# EAGLE design CFA_c (EAGLE 9.4.2)
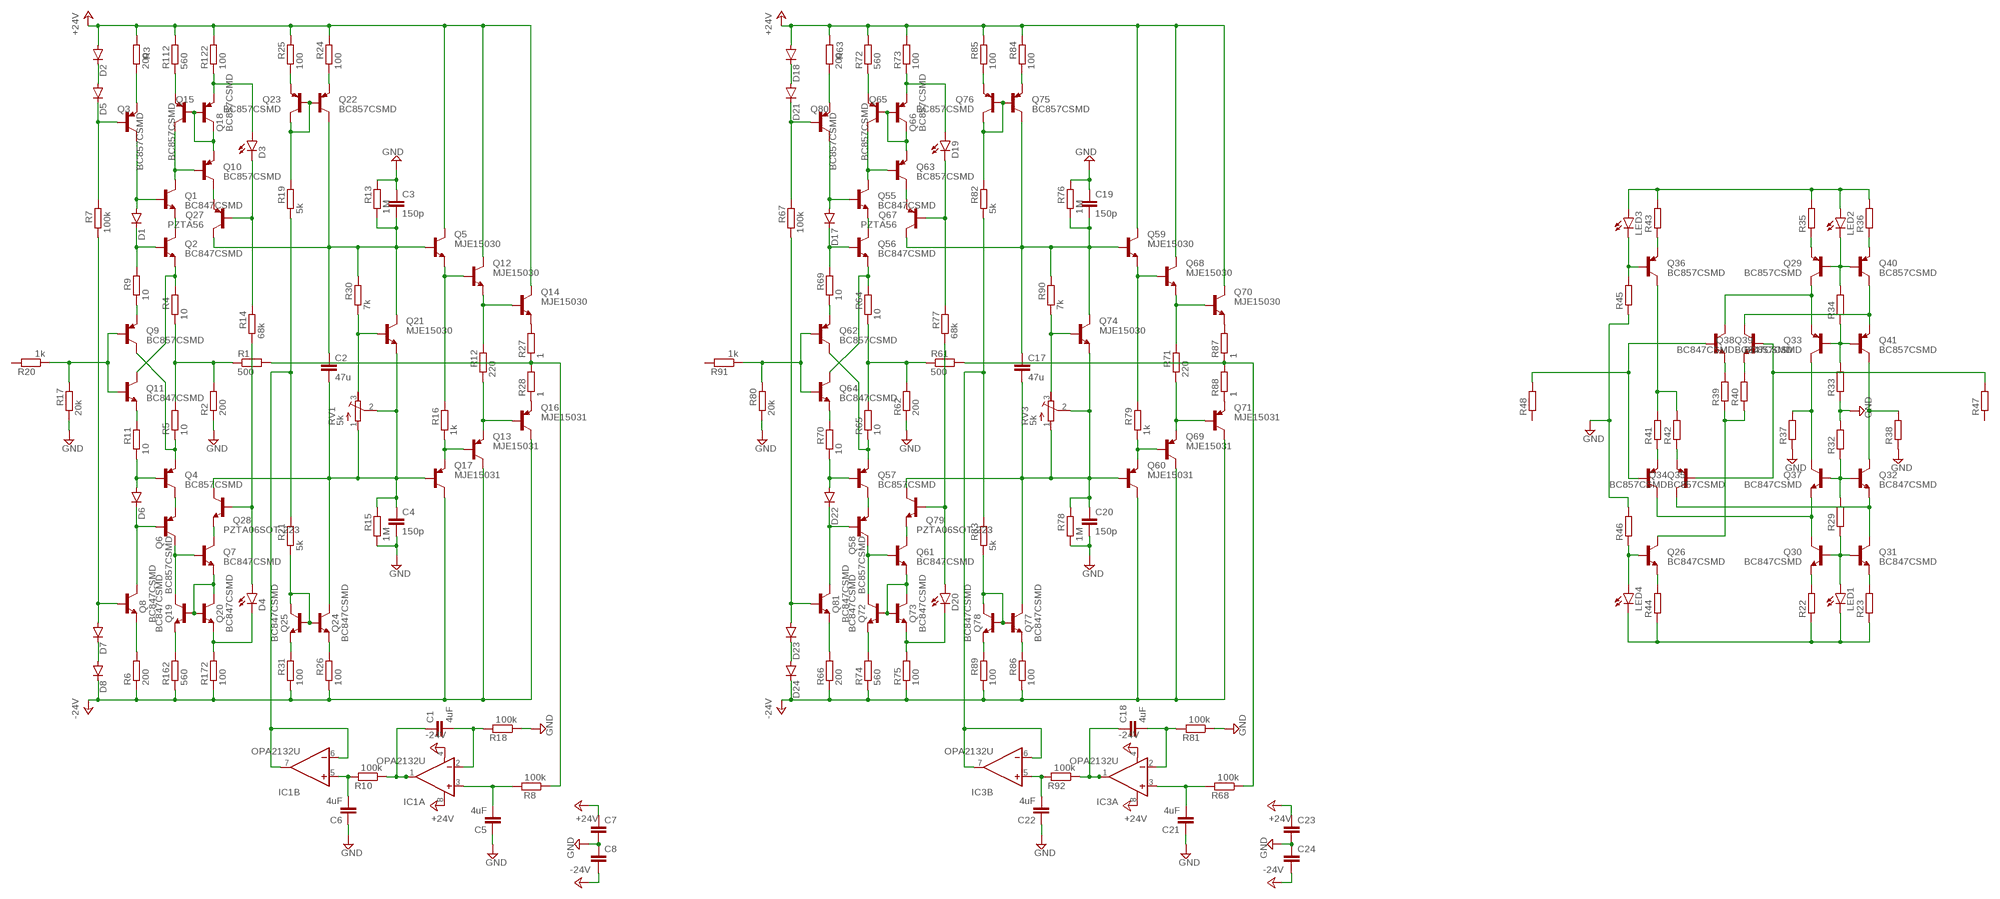
[diagram p0: schematic, sheet 1]

## Parts
C1  4uF  C-EUC1210  [C1210]
C2  47u  C-EUC1210  [C1210]
C3  150p  C-EUC0805  [C0805]
C4  150p  C-EUC0805  [C0805]
C5  4uF  C-EUC1210  [C1210]
C6  4uF  C-EUC1210  [C1210]
C7  C-EUC0603K  [C0603K]
C8  C-EUC0603K  [C0603K]
C17  47u  C-EUC1210  [C1210]
C18  4uF  C-EUC1210  [C1210]
C19  150p  C-EUC0805  [C0805]
C20  150p  C-EUC0805  [C0805]
C21  4uF  C-EUC1210  [C1210]
C22  4uF  C-EUC1210  [C1210]
C23  C-EUC0603K  [C0603K]
C24  C-EUC0603K  [C0603K]
D1  DIODE-SOD80C  [SOD80C]
D2  DIODE-SOD80C  [SOD80C]
D3  LEDCHIPLED_1206  [CHIPLED_1206]
D4  LEDCHIPLED_1206  [CHIPLED_1206]
D5  DIODE-SOD80C  [SOD80C]
D6  DIODE-SOD80C  [SOD80C]
D7  DIODE-SOD80C  [SOD80C]
D8  DIODE-SOD80C  [SOD80C]
D17  DIODE-SOD80C  [SOD80C]
D18  DIODE-SOD80C  [SOD80C]
D19  LEDCHIPLED_1206  [CHIPLED_1206]
D20  LEDCHIPLED_1206  [CHIPLED_1206]
D21  DIODE-SOD80C  [SOD80C]
D22  DIODE-SOD80C  [SOD80C]
D23  DIODE-SOD80C  [SOD80C]
D24  DIODE-SOD80C  [SOD80C]
IC1  OPA2132U  [SO08]
IC3  OPA2132U  [SO08]
LED1  LEDCHIPLED_1206  [CHIPLED_1206]
LED2  LEDCHIPLED_1206  [CHIPLED_1206]
LED3  LEDCHIPLED_1206  [CHIPLED_1206]
LED4  LEDCHIPLED_1206  [CHIPLED_1206]
Q1  BC847CSMD  [SOT23]
Q2  BC847CSMD  [SOT23]
Q3  BC857CSMD  [SOT23-BEC]
Q4  BC857CSMD  [SOT23-BEC]
Q5  MJE15030  MJD31C  [DPAK]
Q6  BC857CSMD  [SOT23-BEC]
Q7  BC847CSMD  [SOT23]
Q8  BC847CSMD  [SOT23]
Q9  BC857CSMD  [SOT23-BEC]
Q10  BC857CSMD  [SOT23-BEC]
Q11  BC847CSMD  [SOT23]
Q12  MJE15030  MJD31C  [DPAK]
Q13  MJE15031  MJD32C  [DPAK]
Q14  MJE15030  MJD31C  [DPAK]
Q15  BC857CSMD  [SOT23-BEC]
Q16  MJE15031  MJD32C  [DPAK]
Q17  MJE15031  MJD32C  [DPAK]
Q18  BC857CSMD  [SOT23-BEC]
Q19  BC847CSMD  [SOT23]
Q20  BC847CSMD  [SOT23]
Q21  MJE15030  MJD31C  [DPAK]
Q22  BC857CSMD  [SOT23-BEC]
Q23  BC857CSMD  [SOT23-BEC]
Q24  BC847CSMD  [SOT23]
Q25  BC847CSMD  [SOT23]
Q26  BC847CSMD  [SOT23]
Q27  PZTA56  [SOT223]
Q28  PZTA06SOT-223  [SOT223]
Q29  BC857CSMD  [SOT23-BEC]
Q30  BC847CSMD  [SOT23]
Q31  BC847CSMD  [SOT23]
Q32  BC847CSMD  [SOT23]
Q33  BC857CSMD  [SOT23-BEC]
Q34  BC857CSMD  [SOT23-BEC]
Q35  BC857CSMD  [SOT23-BEC]
Q36  BC857CSMD  [SOT23-BEC]
Q37  BC847CSMD  [SOT23]
Q38  BC847CSMD  [SOT23]
Q39  BC847CSMD  [SOT23]
Q40  BC857CSMD  [SOT23-BEC]
Q41  BC857CSMD  [SOT23-BEC]
Q55  BC847CSMD  [SOT23]
Q56  BC847CSMD  [SOT23]
Q57  BC857CSMD  [SOT23-BEC]
Q58  BC857CSMD  [SOT23-BEC]
Q59  MJE15030  MJD31C  [DPAK]
Q60  MJE15031  MJD32C  [DPAK]
Q61  BC847CSMD  [SOT23]
Q62  BC857CSMD  [SOT23-BEC]
Q63  BC857CSMD  [SOT23-BEC]
Q64  BC847CSMD  [SOT23]
Q65  BC857CSMD  [SOT23-BEC]
Q66  BC857CSMD  [SOT23-BEC]
Q67  PZTA56  [SOT223]
Q68  MJE15030  MJD31C  [DPAK]
Q69  MJE15031  MJD32C  [DPAK]
Q70  MJE15030  MJD31C  [DPAK]
Q71  MJE15031  MJD32C  [DPAK]
Q72  BC847CSMD  [SOT23]
Q73  BC847CSMD  [SOT23]
Q74  MJE15030  MJD31C  [DPAK]
Q75  BC857CSMD  [SOT23-BEC]
Q76  BC857CSMD  [SOT23-BEC]
Q77  BC847CSMD  [SOT23]
Q78  BC847CSMD  [SOT23]
Q79  PZTA06SOT-223  [SOT223]
Q80  BC857CSMD  [SOT23-BEC]
Q81  BC847CSMD  [SOT23]
R1  500  R-EU_MELF0204W  [MINI_MELF-0204W]
R2  200  R-EU_MELF0204W  [MINI_MELF-0204W]
R3  200  R-EU_MELF0204W  [MINI_MELF-0204W]
R4  10  R-EU_MELF0204W  [MINI_MELF-0204W]
R5  10  R-EU_MELF0204W  [MINI_MELF-0204W]
R6  200  R-EU_MELF0204W  [MINI_MELF-0204W]
R7  100k  R-EU_MELF0204W  [MINI_MELF-0204W]
R8  100k  R-EU_MELF0204W  [MINI_MELF-0204W]
R9  10  R-EU_MELF0204W  [MINI_MELF-0204W]
R10  100k  R-EU_MELF0204W  [MINI_MELF-0204W]
R11  10  R-EU_MELF0204W  [MINI_MELF-0204W]
R12  220  R-EU_MELF0204W  [MINI_MELF-0204W]
R13  1M  R-EU_MELF0204W  [MINI_MELF-0204W]
R14  68k  R-EU_MELF0204W  [MINI_MELF-0204W]
R15  1M  R-EU_MELF0204W  [MINI_MELF-0204W]
R16  1k  R-EU_MELF0204W  [MINI_MELF-0204W]
R17  20k  R-EU_MELF0204W  [MINI_MELF-0204W]
R18  100k  R-EU_MELF0204W  [MINI_MELF-0204W]
R19  5k  R-EU_MELF0204W  [MINI_MELF-0204W]
R20  1k  R-EU_MELF0204W  [MINI_MELF-0204W]
R21  5k  R-EU_MELF0204W  [MINI_MELF-0204W]
R22  R-EU_MELF0204W  [MINI_MELF-0204W]
R23  R-EU_MELF0204W  [MINI_MELF-0204W]
R24  100  R-EU_MELF0204W  [MINI_MELF-0204W]
R25  100  R-EU_MELF0204W  [MINI_MELF-0204W]
R26  100  R-EU_MELF0204W  [MINI_MELF-0204W]
R27  1  R-EU_R4527  [R4527]
R28  1  R-EU_R4527  [R4527]
R29  R-EU_MELF0204W  [MINI_MELF-0204W]
R30  7k  R-EU_MELF0204W  [MINI_MELF-0204W]
R31  100  R-EU_MELF0204W  [MINI_MELF-0204W]
R32  R-EU_MELF0204W  [MINI_MELF-0204W]
R33  R-EU_MELF0204W  [MINI_MELF-0204W]
R34  R-EU_MELF0204W  [MINI_MELF-0204W]
R35  R-EU_MELF0204W  [MINI_MELF-0204W]
R36  R-EU_MELF0204W  [MINI_MELF-0204W]
R37  R-EU_MELF0204W  [MINI_MELF-0204W]
R38  R-EU_MELF0204W  [MINI_MELF-0204W]
R39  R-EU_MELF0204W  [MINI_MELF-0204W]
R40  R-EU_MELF0204W  [MINI_MELF-0204W]
R41  R-EU_MELF0204W  [MINI_MELF-0204W]
R42  R-EU_MELF0204W  [MINI_MELF-0204W]
R43  R-EU_MELF0204W  [MINI_MELF-0204W]
R44  R-EU_MELF0204W  [MINI_MELF-0204W]
R45  R-EU_MELF0204W  [MINI_MELF-0204W]
R46  R-EU_MELF0204W  [MINI_MELF-0204W]
R47  R-EU_MELF0204W  [MINI_MELF-0204W]
R48  R-EU_MELF0204W  [MINI_MELF-0204W]
R61  500  R-EU_MELF0204W  [MINI_MELF-0204W]
R62  200  R-EU_MELF0204W  [MINI_MELF-0204W]
R63  200  R-EU_MELF0204W  [MINI_MELF-0204W]
R64  10  R-EU_MELF0204W  [MINI_MELF-0204W]
R65  10  R-EU_MELF0204W  [MINI_MELF-0204W]
R66  200  R-EU_MELF0204W  [MINI_MELF-0204W]
R67  100k  R-EU_MELF0204W  [MINI_MELF-0204W]
R68  100k  R-EU_MELF0204W  [MINI_MELF-0204W]
R69  10  R-EU_MELF0204W  [MINI_MELF-0204W]
R70  10  R-EU_MELF0204W  [MINI_MELF-0204W]
R71  220  R-EU_MELF0204W  [MINI_MELF-0204W]
R72  560  R-EU_MELF0204W  [MINI_MELF-0204W]
R73  100  R-EU_MELF0204W  [MINI_MELF-0204W]
R74  560  R-EU_MELF0204W  [MINI_MELF-0204W]
R75  100  R-EU_MELF0204W  [MINI_MELF-0204W]
R76  1M  R-EU_MELF0204W  [MINI_MELF-0204W]
R77  68k  R-EU_MELF0204W  [MINI_MELF-0204W]
R78  1M  R-EU_MELF0204W  [MINI_MELF-0204W]
R79  1k  R-EU_MELF0204W  [MINI_MELF-0204W]
R80  20k  R-EU_MELF0204W  [MINI_MELF-0204W]
R81  100k  R-EU_MELF0204W  [MINI_MELF-0204W]
R82  5k  R-EU_MELF0204W  [MINI_MELF-0204W]
R83  5k  R-EU_MELF0204W  [MINI_MELF-0204W]
R84  100  R-EU_MELF0204W  [MINI_MELF-0204W]
R85  100  R-EU_MELF0204W  [MINI_MELF-0204W]
R86  100  R-EU_MELF0204W  [MINI_MELF-0204W]
R87  1  R-EU_R4527  [R4527]
R88  1  R-EU_R4527  [R4527]
R89  100  R-EU_MELF0204W  [MINI_MELF-0204W]
R90  7k  R-EU_MELF0204W  [MINI_MELF-0204W]
R91  1k  R-EU_MELF0204W  [MINI_MELF-0204W]
R92  100k  R-EU_MELF0204W  [MINI_MELF-0204W]
R112  560  R-EU_MELF0204W  [MINI_MELF-0204W]
R122  100  R-EU_MELF0204W  [MINI_MELF-0204W]
R162  560  R-EU_MELF0204W  [MINI_MELF-0204W]
R172  100  R-EU_MELF0204W  [MINI_MELF-0204W]
RV1  5k  R-TRIMMTS63Y  [RTRIMTS63Y]
RV3  5k  R-TRIMMTS63Y  [RTRIMTS63Y]

## Nets
+24V: C7.1 C23.1 D2.A D18.A IC1.8(A:V+) IC3.8(A:V+) Q5.4(C) Q12.4(C) Q14.4(C) Q59.4(C) Q68.4(C) Q70.4(C) R3.2 R24.2 R25.2 R63.2 R72.2 R73.2 R84.2 R85.2 R112.2 R122.2
-24V: C8.2 C24.2 D8.C D24.C IC1.4(A:V-) IC3.4(A:V-) Q13.4(C) Q16.4(C) Q17.4(C) Q60.4(C) Q69.4(C) Q71.4(C) R6.1 R26.1 R31.1 R66.1 R74.1 R75.1 R86.1 R89.1 R162.1 R172.1
GND: C3.1 C4.2 C5.1 C6.1 C7.2 C8.1 C19.1 C20.2 C21.1 C22.1 C23.2 C24.1 R2.1 R13.2 R15.1 R17.1 R18.1 R32.2 R33.1 R37.1 R38.1 R45.1 R46.2 R62.1 R76.2 R78.1 R80.1 R81.1
N$1: Q21.1(B) R30.1 RV1.3(E)
N$2: Q3.E R3.1
N$3: D1.A Q1.1(B) Q3.C
N$4: D2.C D5.A
N$5: D5.C Q3.B R7.2
N$6: D1.C Q2.1(B) R9.2
N$7: Q1.2(E) Q2.3(C)
N$8: Q2.2(E) Q11.3(C) R4.2
N$9: R1.1 R2.2 R4.1 R5.2
N$10: Q4.E Q9.C R5.1
N$11: Q4.C Q6.E
N$12: D6.A Q4.B R11.1
N$13: D6.C Q6.B Q8.3(C)
N$14: Q8.2(E) R6.2
N$15: D7.A Q8.1(B) R7.1
N$16: D7.C D8.A
N$17: C1.1 IC1.1(A:OUT) R10.1
N$18: C6.2 IC1.5(B:+IN) R10.2
N$19: Q9.E R9.1
N$20: Q11.2(E) R11.2
N$21: Q15.E R112.1
N$22: Q9.B Q11.1(B) R17.2 R20.1
N$23: Q1.3(C) Q10.B Q15.C
N$24: Q10.E Q15.B Q18.B Q18.C
N$25: D3.A Q18.E R122.1
N$26: Q10.C Q27.3(E)
N$27: D3.C Q27.1(B) R14.2
N$28: Q7.2(E) Q19.1(B) Q20.1(B) Q20.3(C)
N$29: D4.C Q20.2(E) R172.2
N$30: Q19.2(E) R162.2
N$31: Q6.C Q7.1(B) Q19.3(C)
N$32: Q7.3(C) Q28.3(E)
N$33: D4.A Q28.1(B) R14.1
N$35: Q12.3(E) Q14.1(B) R12.2
N$36: C2.1 C3.2 Q5.1(B) Q21.4(C) Q22.C Q27.2(C) Q27.4(C) R13.1 R30.2
N$37: Q22.B Q23.B Q23.C R19.2
N$38: Q24.1(B) Q25.1(B) Q25.3(C) R21.1
N$39: Q23.E R25.1
N$40: Q22.E R24.1
N$41: IC1.6(B:-IN) IC1.7(B:OUT) R19.1 R21.2
N$42: R1.2 R8.1 R27.1 R28.2
N$43: Q25.2(E) R31.2
N$44: Q24.2(E) R26.2
N$45: Q5.3(E) Q12.1(B) R16.2
N$47: Q13.1(B) Q17.3(E) R16.1
N$48: C2.2 C4.1 Q17.1(B) Q21.3(E) Q24.3(C) Q28.2(C) Q28.4(C) R15.2 RV1.1(A) RV1.2(S)
N$50: Q13.3(E) Q16.1(B) R12.1
N$51: Q14.3(E) R27.2
N$52: Q16.3(E) R28.1
N$53: C1.2 IC1.2(A:-IN) R18.2
N$55: C5.2 IC1.3(A:+IN) R8.2
N$92: LED1.C LED4.C R22.1 R23.1 R44.1
N$93: Q30.2(E) R22.2
N$94: Q31.2(E) R23.2
N$95: Q31.3(C) Q32.2(E) Q34.C
N$96: Q30.3(C) Q35.C Q37.2(E)
N$97: LED1.A Q30.1(B) Q31.1(B) R29.1
N$98: Q32.1(B) Q37.1(B) R29.2 R32.1
N$99: Q33.C Q37.3(C) R37.2
N$100: Q32.3(C) Q41.C R38.2
N$101: Q33.B Q41.B R33.2 R34.1
N$102: Q29.C Q33.E Q39.3(C)
N$103: LED2.C Q29.B Q40.B R34.2
N$104: Q38.3(C) Q40.C Q41.E
N$105: Q29.E R35.1
N$106: Q40.E R36.1
N$107: LED2.A LED3.A R35.2 R36.2 R43.2
N$108: LED3.C Q36.B R45.2
N$109: Q36.E R43.1
N$110: Q36.C R41.2 R42.2
N$111: Q34.E R42.1
N$112: Q35.E R41.1
N$113: Q34.B Q38.1(B) R47.2
N$114: Q35.B Q39.1(B) R48.2
N$115: Q39.2(E) R39.2
N$116: Q38.2(E) R40.2
N$117: Q26.3(C) R39.1 R40.1
N$118: Q26.2(E) R44.2
N$119: LED4.A Q26.1(B) R46.1
N$122: Q74.1(B) R90.1 RV3.3(E)
N$183: Q80.E R63.1
N$184: D17.A Q55.1(B) Q80.C
N$185: D18.C D21.A
N$186: D21.C Q80.B R67.2
N$187: D17.C Q56.1(B) R69.2
N$188: Q55.2(E) Q56.3(C)
N$189: Q56.2(E) Q64.3(C) R64.2
N$190: R61.1 R62.2 R64.1 R65.2
N$191: Q57.E Q62.C R65.1
N$192: D22.A Q57.B R70.1
N$193: D22.C Q58.B Q81.3(C)
N$194: Q81.2(E) R66.2
N$195: D23.C D24.A
N$196: Q57.C Q58.E
N$197: Q62.E R69.1
N$198: Q64.2(E) R70.2
N$199: Q62.B Q64.1(B) R80.2 R91.1
N$200: Q55.3(C) Q63.B Q65.C
N$201: Q63.E Q65.B Q66.B Q66.C
N$202: Q65.E R72.1
N$203: D19.A Q66.E R73.1
N$204: Q63.C Q67.3(E)
N$205: D19.C Q67.1(B) R77.2
N$206: Q61.2(E) Q72.1(B) Q73.1(B) Q73.3(C)
N$207: D20.C Q73.2(E) R75.2
N$208: Q72.2(E) R74.2
N$209: Q58.C Q61.1(B) Q72.3(C)
N$210: Q61.3(C) Q79.3(E)
N$211: D20.A Q79.1(B) R77.1
N$212: C17.1 C19.2 Q59.1(B) Q67.2(C) Q67.4(C) Q74.4(C) Q75.C R76.1 R90.2
N$213: Q75.B Q76.B Q76.C R82.2
N$214: Q77.1(B) Q78.1(B) Q78.3(C) R83.1
N$215: Q76.E R85.1
N$216: Q75.E R84.1
N$217: IC3.6(B:-IN) IC3.7(B:OUT) R82.1 R83.2
N$218: R61.2 R68.1 R87.1 R88.2
N$219: Q78.2(E) R89.2
N$220: Q77.2(E) R86.2
N$221: Q59.3(E) Q68.1(B) R79.2
N$222: Q60.3(E) Q69.1(B) R79.1
N$223: C17.2 C20.1 Q60.1(B) Q74.3(E) Q77.3(C) Q79.2(C) Q79.4(C) R78.2 RV3.1(A) RV3.2(S)
N$224: Q68.3(E) Q70.1(B) R71.2
N$225: Q69.3(E) Q71.1(B) R71.1
N$226: Q70.3(E) R87.2
N$227: Q71.3(E) R88.1
N$228: C18.2 IC3.2(A:-IN) R81.2
N$229: C21.2 IC3.3(A:+IN) R68.2
N$230: D23.A Q81.1(B) R67.1
N$232: C18.1 IC3.1(A:OUT) R92.1
N$233: C22.2 IC3.5(B:+IN) R92.2
Unconnected: R20.2 R47.1 R48.1 R91.2

## Library data of the parts
C1-C6 C17-C22 = Vwvwbg:C-EU: CAPACITOR, European symbol; SPICEPREFIX: C
C7 C8 C23 C24 = Vwvwbg:C-EU: CAPACITOR, European symbol
D1 D2 D5-D8 D17 D18 D21-D24 = diode:DIODE-: DIODE; SPICEPREFIX: D
D3 D4 D19 D20 LED4 = led:LED: LED OSRAM: - CHIPLED LG R971, LG N971, LY N971, LG Q971, LY Q971, LO R971, LY R971 LH N974, LH R974 LS Q976, LO Q976, LY Q976 LO Q996 - Hyper CHIPLED LW Q18S LB Q993, LB Q99A, LB R99A - SideLED LS A670, LO A670, LY A670, LG A670, LP A670 LB A673, LV A673, LT A673, LW A673 LH A674 LY A675 LS A676, LA A676, LO A676, LY A676, LW A676 LS A679, LY A679, LG A679 - Hyper Micro SIDELED® LS Y876, LA Y876, LO Y876, LY Y876 LT Y87S - SmartLED LW L88C, LW L88S LB L89C, LB L89S, LG L890 LS L89K, LO L89K, LY L89K LS L896, LA L896, LO L896, LY L896 - TOPLED LS T670, LO T670, LY T670, LG T670, LP T670 LSG T670, LSP T670, LSY T670, LOP T670, LYG T670 LG T671, LOG T671, LSG T671 LB T673, LV T673, LT T673, LW T673 LH T674 LS T676, LA T676, LO T676, LY T676, LB T676, LH T676, LSB T676, LW T676 LB T67C, LV T67C, LT T67C, LS T67K, LO T67K, LY T67K, LW E67C LS E67B, LA E67B, LO E67B, LY E67B, LB E67C, LV E67C, LT E67C LW T67C LS T679, LY T679, LG T679 LS T770, LO T770, LY T770, LG T770, LP T770 LB T773, LV T773, LT T773, LW T773 LH T774 LS E675, LA E675, LY E675, LS T675 LS T776, LA T776, LO T776, LY T776, LB T776 LHGB T686 LT T68C, LB T68C - Hyper Mini TOPLED® LB M676 - Mini TOPLED Santana® LG M470 LS M47K, LO M47K, LY M47K Source: http://www.osram.convergy.de LUXEON: - LUMILED® LXK2-PW12-R00, LXK2-PW12-S00, LXK2-PW14-U00, LXK2-PW14-V00 LXK2-PM12-R00, LXK2-PM12-S00, LXK2-PM14-U00 LXK2-PE12-Q00, LXK2-PE12-R00, LXK2-PE12-S00, LXK2-PE14-T00, LXK2-PE14-U00 LXK2-PB12-K00, LXK2-PB12-L00, LXK2-PB12-M00, LXK2-PB14-N00, LXK2-PB14-P00, LXK2-PB14-Q00 LXK2-PR12-L00, LXK2-PR12-M00, LXK2-PR14-Q00, LXK2-PR14-R00 LXK2-PD12-Q00, LXK2-PD12-R00, LXK2-PD12-S00 LXK2-PH12-R00, LXK2-PH12-S00 LXK2-PL12-P00, LXK2-PL12-Q00, LXK2-PL12-R00 Source: www.luxeon.com KINGBRIGHT: KA-3528ASYC Source: www.kingbright.com; SPICEPREFIX: D
IC1 IC3 = burr-brown:OPA2132: High Speed FET-Input Operational Amplifiers< Product Folder:OPA2132; MF: TEXAS INSTRUMENTS; MPN: OPA2132U; OC_FARNELL: 1206934; OC_NEWARK: 80K6015
LED1-LED3 = led:LED: LED OSRAM: - CHIPLED LG R971, LG N971, LY N971, LG Q971, LY Q971, LO R971, LY R971 LH N974, LH R974 LS Q976, LO Q976, LY Q976 LO Q996 - Hyper CHIPLED LW Q18S LB Q993, LB Q99A, LB R99A - SideLED LS A670, LO A670, LY A670, LG A670, LP A670 LB A673, LV A673, LT A673, LW A673 LH A674 LY A675 LS A676, LA A676, LO A676, LY A676, LW A676 LS A679, LY A679, LG A679 - Hyper Micro SIDELED® LS Y876, LA Y876, LO Y876, LY Y876 LT Y87S - SmartLED LW L88C, LW L88S LB L89C, LB L89S, LG L890 LS L89K, LO L89K, LY L89K LS L896, LA L896, LO L896, LY L896 - TOPLED LS T670, LO T670, LY T670, LG T670, LP T670 LSG T670, LSP T670, LSY T670, LOP T670, LYG T670 LG T671, LOG T671, LSG T671 LB T673, LV T673, LT T673, LW T673 LH T674 LS T676, LA T676, LO T676, LY T676, LB T676, LH T676, LSB T676, LW T676 LB T67C, LV T67C, LT T67C, LS T67K, LO T67K, LY T67K, LW E67C LS E67B, LA E67B, LO E67B, LY E67B, LB E67C, LV E67C, LT E67C LW T67C LS T679, LY T679, LG T679 LS T770, LO T770, LY T770, LG T770, LP T770 LB T773, LV T773, LT T773, LW T773 LH T774 LS E675, LA E675, LY E675, LS T675 LS T776, LA T776, LO T776, LY T776, LB T776 LHGB T686 LT T68C, LB T68C - Hyper Mini TOPLED® LB M676 - Mini TOPLED Santana® LG M470 LS M47K, LO M47K, LY M47K Source: http://www.osram.convergy.de LUXEON: - LUMILED® LXK2-PW12-R00, LXK2-PW12-S00, LXK2-PW14-U00, LXK2-PW14-V00 LXK2-PM12-R00, LXK2-PM12-S00, LXK2-PM14-U00 LXK2-PE12-Q00, LXK2-PE12-R00, LXK2-PE12-S00, LXK2-PE14-T00, LXK2-PE14-U00 LXK2-PB12-K00, LXK2-PB12-L00, LXK2-PB12-M00, LXK2-PB14-N00, LXK2-PB14-P00, LXK2-PB14-Q00 LXK2-PR12-L00, LXK2-PR12-M00, LXK2-PR14-Q00, LXK2-PR14-R00 LXK2-PD12-Q00, LXK2-PD12-R00, LXK2-PD12-S00 LXK2-PH12-R00, LXK2-PH12-S00 LXK2-PL12-P00, LXK2-PL12-Q00, LXK2-PL12-R00 Source: www.luxeon.com KINGBRIGHT: KA-3528ASYC Source: www.kingbright.com
Q1 Q2 Q7 Q8 Q11 Q19 Q20 Q24-Q26 Q30-Q32 Q37-Q39 Q55 Q56 Q61 Q64 Q72 Q73 Q77 Q78 Q81 = transistor-npn:BC847*: NPN Transistor; SPICEPREFIX: Q
Q3 Q4 Q6 Q9 Q10 Q15 Q18 Q22 Q23 Q29 Q33-Q36 Q40 Q41 Q57 Q58 Q62 Q63 Q65 Q66 Q75 Q76 Q80 = transistor-pnp:BC857*: PNP Transistror; SPICEPREFIX: Q
Q5 Q12 Q14 Q21 Q59 Q68 Q70 Q74 = transistor:MJD31*: Complementary Power Transistors; SPICEPREFIX: Q
Q13 Q16 Q17 Q60 Q69 Q71 = transistor:MJD32*: Complementary Power Transistors; SPICEPREFIX: Q
Q27 Q67 = Vwvwbg:PZTA56; SPICEPREFIX: Q
Q28 Q79 = Vwvwbg:PZTA06; SPICEPREFIX: Q
R1-R21 R24-R28 R30 R31 R44 R61-R92 R112 R122 R162 R172 = Vwvwbg:R-EU_: RESISTOR, European symbol; SPICEPREFIX: R
R22 R23 R29 R32-R43 R45-R48 = Vwvwbg:R-EU_: RESISTOR, European symbol
RV1 RV3 = Vwvwbg:R-TRIMM: Trimm resistor; SPICEMODEL: X; SPICEPREFIX: Z; SPICEPREFIXL: POT

## Board
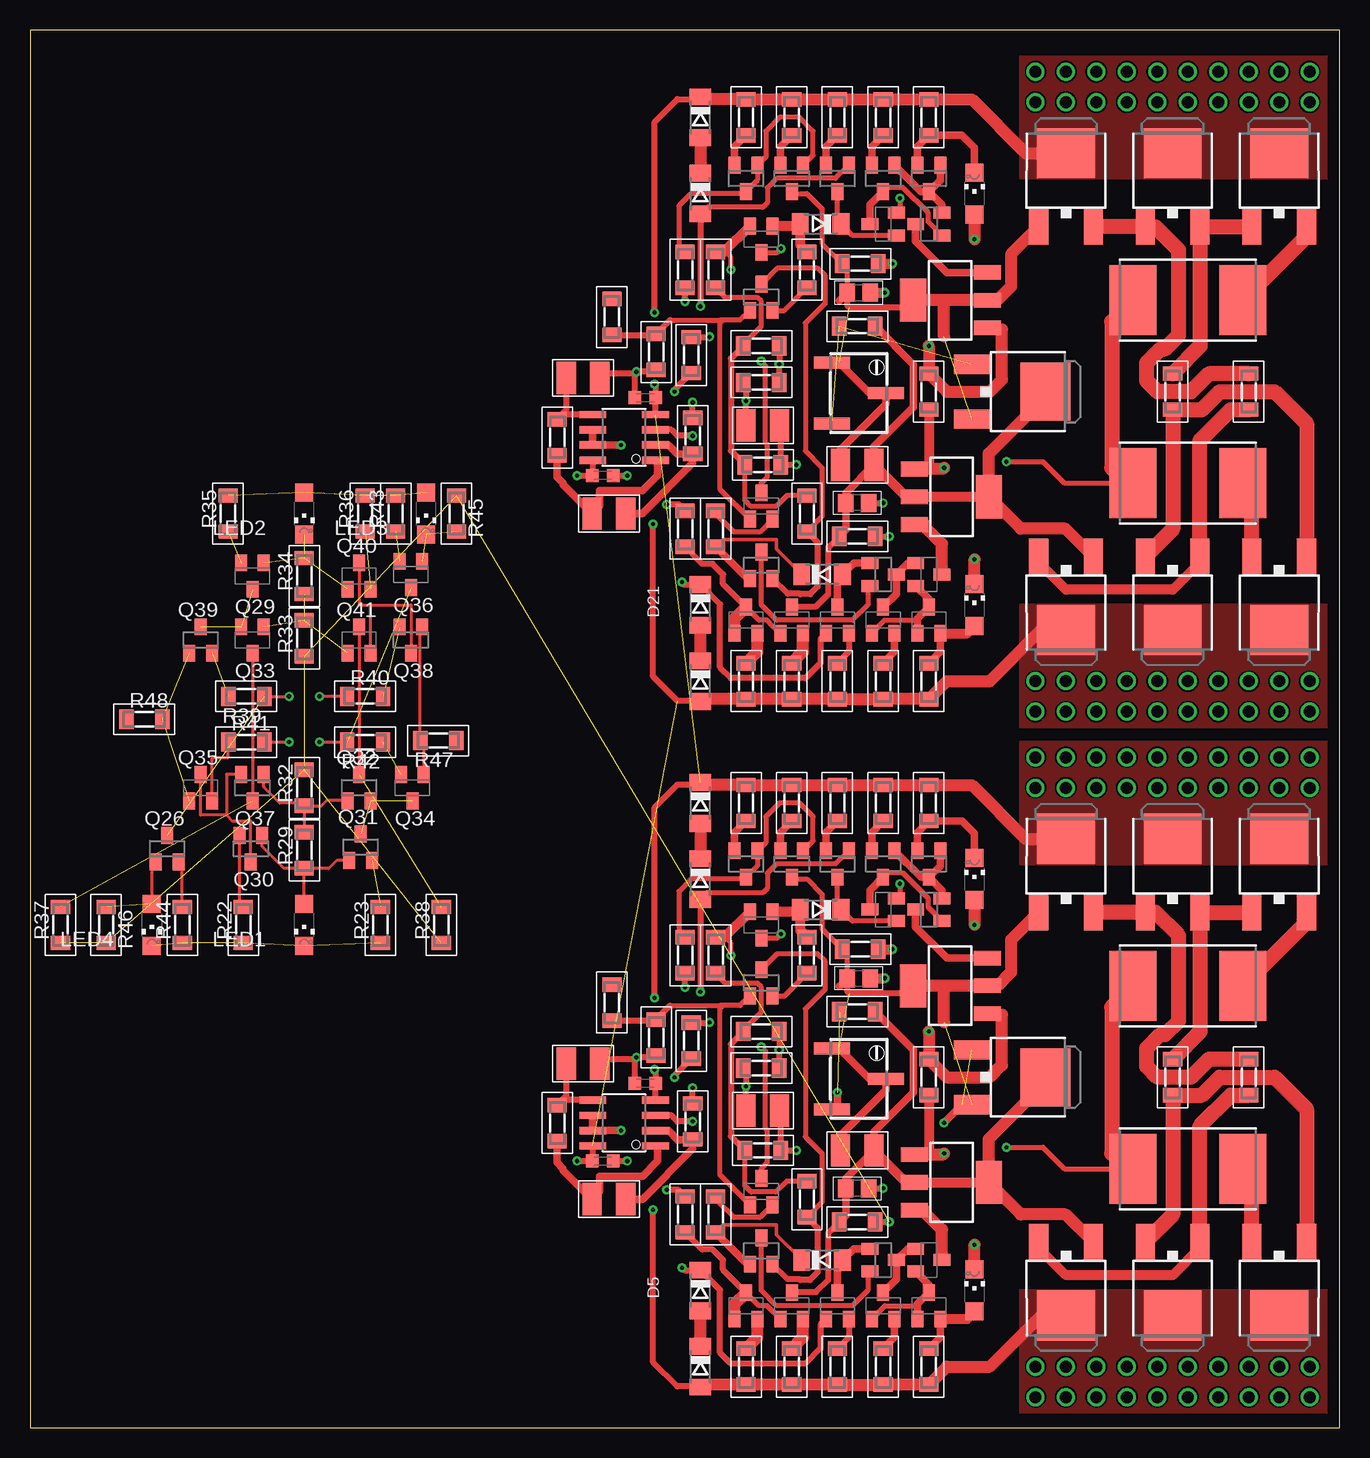
[diagram p1: board, top side]
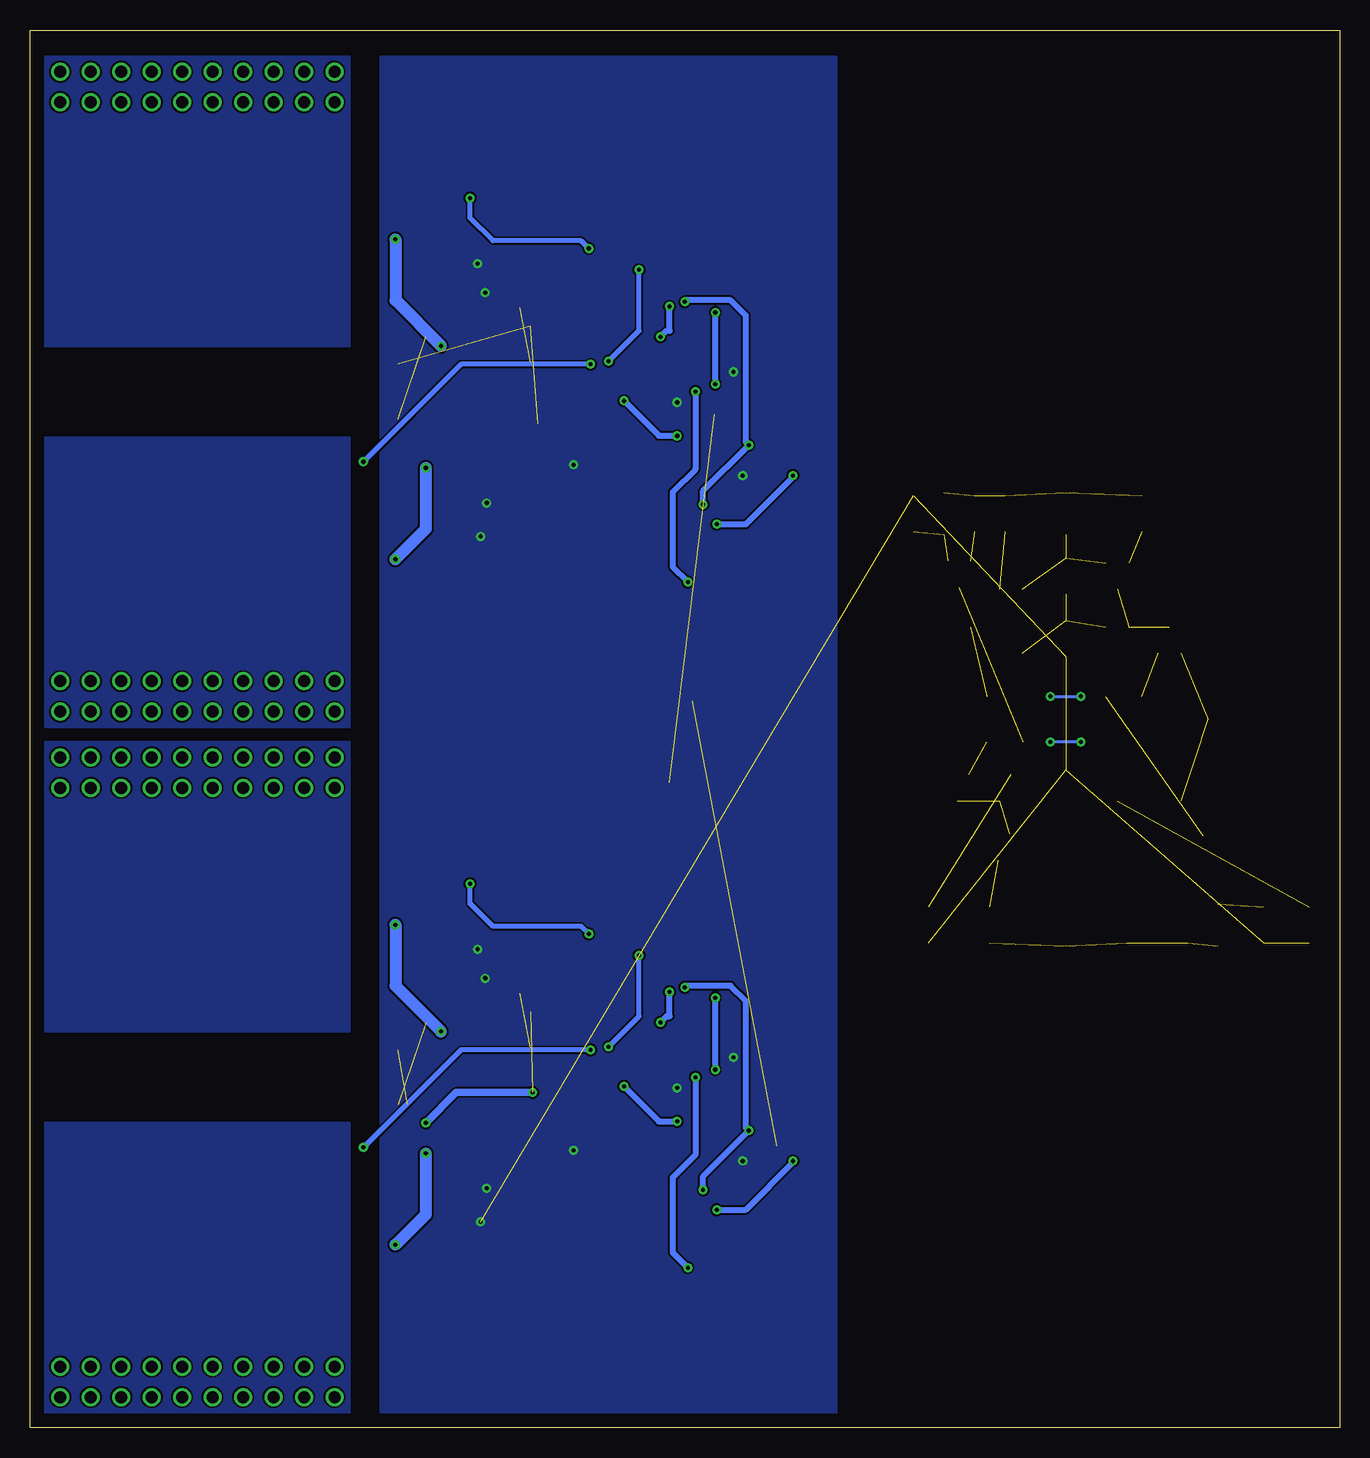
[diagram p2: board, bottom side, seen from below]

Size 109.2 x 116.51 mm. Coordinates in mm from the lower left corner, seen from the top.
Outline: 0,0 109.2,0 109.2,116.51 0,116.51 0,0
Copper layers (1*16): Top 0.035mm / dielectric 1.5mm / Bottom 0.035mm
Design rules "default *": minimum track width 6mil, minimum drill 0.35mm, track to track 6mil, track to pad 6mil, pad to pad 6mil, via to via 6mil, smd to smd 6mil, copper to edge 40mil, drill to drill 6mil, minimum pad ring 10mil, minimum via ring 8mil, stop-mask expansion 4mil, vias tented up to drill 0.35mm, thermal gap 10mil

### Footprints (pad centres in the part's own frame; a part is rotated, then mirrored left to right if it is on the bottom)
C1210 = smd 1.6 x 2.7: 1 -1.4,0; 2 1.4,0
C0805 = smd 1.3 x 1.5: 1 -0.95,0; 2 0.95,0
C0603K = smd 1.05 x 1.08: 1 -0.875,0; 2 0.875,0
SOD80C = smd 1.4 x 1.8: A 1.7,0; C -1.7,0
CHIPLED_1206 = smd 1.5 x 1.5: A 0,-1.75; C 0,1.75
SO08 = smd 0.61 x 2.21: 1 -1.905,-2.616; 2 -0.635,-2.616; 3 0.635,-2.616; 4 1.905,-2.616; 5 1.905,2.616; 6 0.635,2.616; 7 -0.635,2.616; 8 -1.905,2.616
SOT23 = smd 1 x 1.4: 1 -0.95,-1.1; 2 0.95,-1.1; 3 0,1.1
SOT23-BEC = smd 1 x 1.4: B -0.95,-1.1; C 0,1.1; E 0.95,-1.1
DPAK = smd 1.6 x 3: 1 -2.28,-4.04; 3 2.28,-4.04 | smd 4.826 x 4.191: 4 0,2.096
SOT223 = smd 1.219 x 2.235: 1 -2.311,-3.099; 2 0,-3.099; 3 2.311,-3.099 | smd 3.6 x 2.2: 4 0,3.099
MINI_MELF-0204W = smd 1.2 x 1.6: 1 -1.5,0; 2 1.5,0
R4527 = smd 3.94 x 5.84: 1 -4.575,0; 2 4.575,0
RTRIMTS63Y = smd 1 x 3: 1 -2.55,-2.25; 2 0,2.25; 3 2.55,-2.25

### Placement (x,y rotation side)
C1  48.26,19.05 0 top
C2  68.96,23.11 180 top
C3  68.96,19.94 180 top
C4  69.09,37.47 0 top
C5  61.09,26.42 180 top
C6  46.1,30.35 180 top
C7  47.75,22.22 0 top
C8  51.31,28.7 0 top
C17  68.96,80.26 180 top
C18  48.26,76.2 0 top
C19  68.96,77.09 180 top
C20  69.09,94.61 0 top
C21  61.09,83.57 180 top
C22  46.1,87.5 180 top
C23  47.75,79.38 0 top
C24  51.31,85.85 0 top
D1  66.04,13.97 0 top
D2  55.88,5.08 270 top
D3  78.74,11.43 0 top
D4  78.74,45.72 0 top
D5  55.88,11.43 270 top
D6  65.91,43.18 180 top
D7  55.88,45.72 270 top
D8  55.88,52.07 270 top
D17  66.04,71.12 0 top
D18  55.88,62.23 270 top
D19  78.74,68.58 0 top
D20  78.74,102.87 0 top
D21  55.88,68.58 270 top
D22  65.91,100.33 180 top
D23  55.88,102.87 270 top
D24  55.88,109.22 270 top
IC1  49.53,25.4 90 top
IC3  49.53,82.55 90 top
LED1  22.86,41.91 180 top
LED2  22.86,76.2 180 top
LED3  33.02,76.2 180 top
LED4  10.16,41.91 180 top
Q1  71.12,13.97 270 top
Q2  60.96,14.73 0 top
Q3  67.31,10.16 0 top
Q4  60.96,41.91 180 top
Q5  86.36,11.43 180 top
Q6  71.12,43.18 90 top
Q7  74.93,43.18 90 top
Q8  67.31,46.99 180 top
Q9  60.96,19.68 0 top
Q10  74.93,13.97 270 top
Q11  60.96,37.08 0 top
Q12  95.25,11.43 180 top
Q13  95.25,46.99 0 top
Q14  104.14,11.43 180 top
Q15  71.12,10.16 0 top
Q16  104.14,46.99 0 top
Q17  86.36,46.99 0 top
Q18  74.93,10.16 0 top
Q19  71.12,46.99 180 top
Q20  74.93,46.99 180 top
Q21  82.55,29.21 270 top
Q22  63.5,10.16 0 top
Q23  59.69,10.16 0 top
Q24  63.5,46.99 180 top
Q25  59.69,46.99 180 top
Q26  11.43,48.26 0 top
Q27  76.84,20.45 270 top
Q28  76.71,36.83 90 top
Q29  18.54,70.99 180 top
Q30  18.41,48.26 180 top
Q31  27.56,48.39 0 top
Q32  27.43,53.34 0 top
Q33  18.54,65.66 180 top
Q34  31.88,53.34 180 top
Q35  14.22,53.34 0 top
Q36  31.75,71.12 180 top
Q37  18.54,53.34 180 top
Q38  31.75,65.66 180 top
Q39  14.22,65.66 0 top
Q40  27.43,70.99 0 top
Q41  27.43,65.66 0 top
Q55  71.12,71.12 270 top
Q56  60.96,71.88 0 top
Q57  60.96,99.06 180 top
Q58  71.12,100.33 90 top
Q59  86.36,68.58 180 top
Q60  86.36,104.14 0 top
Q61  74.93,100.33 90 top
Q62  60.96,76.83 0 top
Q63  74.93,71.12 270 top
Q64  60.96,94.23 0 top
Q65  71.12,67.31 0 top
Q66  74.93,67.31 0 top
Q67  76.84,77.6 270 top
Q68  95.25,68.58 180 top
Q69  95.25,104.14 0 top
Q70  104.14,68.58 180 top
Q71  104.14,104.14 0 top
Q72  71.12,104.14 180 top
Q73  74.93,104.14 180 top
Q74  82.55,86.36 270 top
Q75  63.5,67.31 0 top
Q76  59.69,67.31 0 top
Q77  63.5,104.14 180 top
Q78  59.69,104.14 180 top
Q79  76.71,93.98 90 top
Q80  67.31,67.31 0 top
Q81  67.31,104.14 180 top
R1  60.96,33.02 0 top
R2  61.09,23.11 180 top
R3  67.31,5.08 270 top
R4  64.77,19.05 270 top
R5  57.15,39.37 270 top
R6  67.31,52.07 270 top
R7  55.12,32.26 270 top
R8  60.96,29.97 180 top
R9  57.15,17.78 270 top
R10  43.94,25.4 90 top
R11  64.77,39.37 270 top
R12  95.25,29.21 270 top
R13  68.96,17.14 0 top
R14  74.93,29.21 270 top
R15  69.22,39.88 180 top
R16  101.6,29.21 270 top
R17  52.2,32.51 90 top
R18  55.25,25.53 270 top
R19  54.61,17.78 270 top
R20  48.51,35.43 90 top
R21  54.61,39.37 270 top
R22  17.78,41.91 90 top
R23  29.21,41.91 90 top
R24  63.5,5.08 270 top
R25  59.69,5.08 270 top
R26  63.5,52.07 270 top
R27  96.52,21.59 0 top
R28  96.52,36.83 180 top
R29  22.86,48.13 90 top
R30  68.96,34.67 0 top
R31  59.69,52.07 270 top
R32  22.86,53.34 90 top
R33  22.86,65.79 90 top
R34  22.86,70.99 90 top
R35  16.51,76.2 90 top
R36  27.94,76.2 90 top
R37  2.54,41.91 90 top
R38  34.29,41.91 90 top
R39  18.03,60.96 180 top
R40  27.94,60.96 0 top
R41  18.03,57.15 0 top
R42  27.94,57.15 180 top
R43  30.48,76.2 90 top
R44  12.7,41.91 90 top
R45  35.56,76.2 270 top
R46  6.35,41.91 270 top
R47  34.04,57.28 180 top
R48  9.53,59.05 0 top
R61  60.96,90.17 0 top
R62  61.09,80.26 180 top
R63  67.31,62.23 270 top
R64  64.77,76.2 270 top
R65  57.15,96.52 270 top
R66  67.31,109.22 270 top
R67  55.12,89.41 270 top
R68  60.96,87.12 180 top
R69  57.15,74.93 270 top
R70  64.77,96.52 270 top
R71  95.25,86.36 270 top
R72  71.12,62.23 270 top
R73  74.93,62.23 270 top
R74  71.12,109.22 270 top
R75  74.93,109.22 270 top
R76  68.96,74.3 0 top
R77  74.93,86.36 270 top
R78  69.22,97.03 180 top
R79  101.6,86.36 270 top
R80  52.2,89.66 90 top
R81  55.25,82.68 270 top
R82  54.61,74.93 270 top
R83  54.61,96.52 270 top
R84  63.5,62.23 270 top
R85  59.69,62.23 270 top
R86  63.5,109.22 270 top
R87  96.52,78.74 0 top
R88  96.52,93.98 180 top
R89  59.69,109.22 270 top
R90  68.96,91.82 0 top
R91  48.51,92.58 90 top
R92  43.94,82.55 90 top
R112  71.12,5.08 270 top
R122  74.93,5.08 270 top
R162  71.12,52.07 270 top
R172  74.93,52.07 270 top
RV1  69.09,29.08 270 top
RV3  69.09,86.23 270 top

### Tracks (layer width: path | path; a pad name or v marks a point on that pad's centre or on a via)
+24V  (via drill 0.35)  (1 unrouted)
  Top 0.508: IC1.8 46.91,22.26 C7.1 v45.59,22.22 | D2.A 55.83,3.43 53.98,3.43 51.94,5.46 v51.94,18.16 | IC3.8 46.91,79.41 C23.1 v45.59,79.38 | D18.A 55.83,60.58 53.98,60.58 51.94,62.61 v51.94,75.31
  Top 1.016: D2.A 56.08,3.58 R25.2 R24.2 R3.2 R112.2 R122.2 76.43,5.08 80.01,5.08 85.09,10.16 85.53,10.16 Q5.4 | D18.A 56.08,60.73 R85.2 R84.2 R63.2 R72.2 R73.2 76.43,62.23 80.01,62.23 85.09,67.31 85.53,67.31 Q59.4
  Bottom 0.508: v51.94,18.16 49.53,18.16 45.59,22.1 v45.59,22.22 | v51.94,75.31 49.53,75.31 45.59,79.25 v45.59,79.38
  pour Top (no thermals): 82.55,11.43 109.22,11.43 109.22,1.27 82.55,1.27
  pour Bottom: 82.55,25.4 107.95,25.4 107.95,1.27 82.55,1.27
  pour Top (no thermals): 82.55,68.58 109.22,68.58 109.22,58.42 82.55,58.42
  pour Bottom: 82.55,82.55 107.95,82.55 107.95,58.42 82.55,58.42
-24V  (via drill 0.35)  (1 unrouted)
  Top 0.508: IC1.4 52.15,28.66 C8.2 52.18,29.73 v52.07,29.84 | v52.07,35.81 52.07,51.69 53.98,53.59 56.06,53.59 56.08,53.57 | IC3.4 52.15,85.81 C24.2 52.18,86.88 v52.07,86.99 | v52.07,92.96 52.07,108.84 53.98,110.74 56.06,110.74 56.08,110.72
  Top 1.016: D8.C 56.08,53.57 R31.1 R26.1 R6.1 R162.1 R172.1 78.51,53.57 82.99,49.09 Q17.4 | D24.C 56.08,110.72 R89.1 R86.1 R66.1 R74.1 R75.1 78.51,110.72 82.99,106.24 Q60.4
  Bottom 0.508: v52.07,29.84 v52.07,35.81 | v52.07,86.99 v52.07,92.96
  pour Top (no thermals): 82.55,57.15 109.22,57.15 109.22,46.99 82.55,46.99
  pour Bottom: 82.55,57.15 107.95,57.15 107.95,33.02 82.55,33.02
  pour Top (no thermals): 82.55,114.3 109.22,114.3 109.22,104.14 82.55,104.14
  pour Bottom: 82.55,114.3 107.95,114.3 107.95,90.17 82.55,90.17
GND  (via drill 0.35)  (6 unrouted)
  Top 0.508: R18.1 v55.25,28.32 | R17.1 52.05,30.86 v50.55,30.86 50.43,30.75 | C8.1 50.43,30.75 | C6.1 47.9,30.75 50.43,30.75 | C7.2 v49.78,22.22 | C5.1 62.59,26.32 R2.1 v63.88,23.11 | C3.1 v71.12,19.94 | R13.2 v71.63,17.14 | R81.1 v55.25,85.47 | R80.1 52.05,88.01 v50.55,88.01 50.43,87.9 | C24.1 50.43,87.9 | C22.1 47.9,87.9 50.43,87.9 | C23.2 v49.78,79.38 | C21.1 62.59,83.47 R62.1 v63.88,80.26 | C19.1 v71.12,77.09 | R76.2 v71.63,74.3
  Top 0.813: C4.2 v71.25,37.47 | R15.1 v71.88,39.88 | C20.2 v71.25,94.61 | R78.1 v71.88,97.03
  pour Bottom: 41.91,114.3 80.01,114.3 80.01,1.27 41.91,1.27
N$1  (via drill 0.35)  (2 unrouted)
  Top 0.61: RV1.3 67.31,27 v67.31,27.94 | v76.2,25.4 77.73,26.93
  Bottom 0.61: v67.31,27.94 73.66,27.94 v76.2,25.4
N$2
  Top 0.508: Q3.E 68.26,7.53 R3.1
N$3
  Top 0.61: Q1.1 68.69,14.92 D1.A 67.31,13.54 Q3.C
N$4
  Top 1.016: D2.C D5.A
N$5  (via drill 0.35)
  Top 0.508: Q3.B 65.91,8.61 65.91,6.6 64.64,5.33 58.42,5.33 57.53,6.22 57.53,11.48 D5.C 54.56,13.13 v54.36,13.33 | R7.2 53.72,29.36 v53.72,29.21
  Bottom 0.508: v54.36,13.33 55.63,14.61 55.63,20.83 53.72,22.73 v53.72,29.21
N$6
  Top 0.305: D1.C 62.23,16.08 62.23,16.89 57.76,16.89 R9.2
  Top 0.61: Q2.1 59.8,13.63 R9.2
N$7
  Top 0.406: Q1.2 69.85,12.85 69.85,11.43 68.58,10.16 62.23,10.16 60.96,11.43 Q2.3
N$8
  Top 0.406: Q11.3 62.27,39.5 65.66,39.5 66.29,38.86 66.29,36.58 64.64,34.93 64.64,24.26 66.04,22.86 66.04,18.82 R4.2
  Top 0.508: R4.2 65.66,16.66 65.66,12.95 65.02,12.32 64.22,12.32 64.17,12.37 63.18,12.37 Q2.2
N$9
  Top 0.406: R4.1 63.09,20.55 62.19,19.64 60.12,19.64 59.59,20.17 R2.2 | R1.1 59.46,33.17 60.96,34.67 60.96,36.74 60.66,37.04 57.98,37.04 R5.2
  Top 0.508: R2.2 58.42,24.28 58.42,31.98 R1.1
N$10  (via drill 0.35)
  Top 0.406: Q9.C 60.96,21.59 61.47,22.1 61.47,24.78 61.33,24.92 61.33,31.38 v60.96,31.75 | v58.42,39.37 58.42,40.4 57.95,40.87 R5.1
  Top 0.813: Q4.E 57.87,40.87 R5.1
  Bottom 0.406: v60.96,31.75 58.42,34.29 v58.42,39.37
N$11  (via drill 0.35)
  Top 0.406: Q4.C 62.27,40.81 v62.61,41.15 | v72.52,45.34 72.52,44.43 Q6.E
  Bottom 0.406: v62.61,41.15 63.25,41.78 70.61,41.78 72.52,43.69 v72.52,45.34
N$12
  Top 0.813: R11.1 64.21,41.43 D6.A 64.04,43.01 Q4.B
N$13
  Top 0.406: Q8.3 67.31,43.48 D6.C 68.56,42.23 Q6.B
N$14
  Top 0.61: R6.2 66.36,49.62 Q8.2
N$15  (via drill 0.35)
  Top 0.406: Q8.1 67.16,46.99 62.23,46.99 61.47,46.23 61.47,44.96 61.09,44.58 56.44,44.58 D7.A
  Top 0.508: D7.A v55.88,36.32 | R7.1 56.62,33.76 v56.64,33.78
  Bottom 0.508: v55.88,36.32 55.88,34.29 56.13,34.29 v56.64,33.78
N$16
  Top 1.016: D8.A D7.C
N$17
  Top 0.61: R10.1 43.94,22.1 44.45,21.59 44.45,21.46 C1.1 47.5,19.69 47.5,20.95 51.05,20.95 52.32,22.22 52.32,23.32 IC1.1
N$18
  Top 0.508: C6.2 44.7,27.66 R10.2 44.35,27.3 IC1.5
N$19
  Top 0.406: Q9.E 60.85,17.53 58.67,17.53 57.15,19.05 R9.1
N$20
  Top 0.406: Q11.2 62.88,35.98 R11.2
N$21
  Top 0.61: R112.1 72.07,7.53 Q15.E
N$22
  Top 0.406: Q9.B 57.53,21.06 57.53,34.93 57.66,35.05 57.53,35.18 | 53.36,35.18 57.53,35.18 | Q11.1 59.2,35.18 57.53,35.18
  Top 0.508: R20.1 52.12,33.93 R17.2 53.36,35.18
N$23
  Top 0.61: Q10.B 73.17,14.92 Q1.3 72.22,12.36 Q15.C
N$24
  Top 0.406: Q15.B 71.27,10.16 73.83,10.16 73.98,10.31
  Top 0.61: Q10.E 74.93,11.92 Q18.C 73.98,10.31 Q18.B
N$25
  Top 0.61: R122.1 75.88,7.53 Q18.E
  Top 0.813: Q18.E 78.12,9.06 D3.A
N$26
  Top 0.61: 74.57,18.14 Q27.3
  Top 1.016: Q10.C 76.03,16.51 74.57,17.97 74.57,18.14
N$27  (via drill 0.35)
  Top 0.813: R14.2 74.93,22.76
  Top 1.016: D3.C v78.74,15.24 | v76.2,22.86 76.1,22.76 74.93,22.76 Q27.1
  Bottom 1.016: v78.74,15.24 76.2,17.78 v76.2,22.86
N$28
  Top 0.61: Q20.1 75.88,46.84 Q20.3 | Q20.3 76.03,44.79 Q7.2 | Q20.3 74.27,45.89 Q19.1
N$29
  Top 0.61: Q20.2 73.98,49.62 R172.2 77.7,50.57 78.74,49.53 D4.C
N$30
  Top 0.61: R162.2 70.17,49.62 Q19.2
N$31
  Top 0.406: Q7.1 74.89,43.37 74.89,44.11 72.77,46.23 71.46,46.23 Q19.3
  Top 0.61: Q19.3 70.02,44.79 Q6.C
N$32
  Top 0.61: Q7.3 73.83,41.74 76.43,39.14 Q28.3
N$33  (via drill 0.35)
  Top 0.61: 81.03,34.42 79.91,34.42 Q28.1
  Top 1.016: 81.03,34.42 81.03,30.23 80.01,29.21 76.43,29.21 R14.1 v74.93,33.02 | D4.A v78.74,41.91
  Bottom 1.016: v78.74,41.91 78.74,36.83 v74.93,33.02
N$34  (via drill 1)
  other vias: 83.82,53.34
N$35
  Top 1.27: Q12.3 95.25,17.75 R12.2 97.69,27.71 99.19,29.21 103.76,29.21 106.42,26.55 Q14.1
N$36
  Top 0.508: Q22.C 63.54,11.3 65.53,11.3 66.55,12.32 66.55,16.23 R13.1
  Top 0.61: R30.2 73.66,31.47 73.66,27.94 70.36,24.64 C2.1 68.01,20.76 C3.2 68.01,17.7 R13.1
  Top 0.813: C2.1 73.03,20.45 Q27.2 Q27.4
  Top 1.016: Q21.4 84.65,28.77 79.93,24.05 Q27.4 82.6,17.78 86.33,17.78 Q5.1
N$37
  Top 0.406: Q22.B 62.01,9.6 62,9.6 61.44,10.16 60.79,10.16 Q23.C
  Top 0.508: Q23.C 57.78,13.16 57.78,13.97 56.9,14.86 56.03,14.86 R19.2
  Top 1.016: Q23.B 58.74,10.31 Q23.C
N$38
  Top 0.406: Q24.1 65.28,48.92 65.28,50.93 64.14,52.07 62.48,52.07 61.34,50.93 61.34,48.79 Q25.1 60.64,46.84 Q25.3 59.52,45.72 55.12,45.72 54.1,44.7 54.1,41.38 R21.1
N$39
  Top 1.016: R25.1 60.64,7.53 Q23.E
N$40
  Top 1.016: R24.1 64.45,7.53 Q22.E
N$41  (via drill 0.35)
  Top 0.508: 54.33,19.56 54.08,19.81 v53.09,19.81 | v54.61,36.7 R21.2
  Top 0.61: IC1.6 IC1.7 v49.28,24.77 | R19.1 54.33,19.56
  Bottom 0.508: v53.09,19.81 53.09,20.95 v49.28,24.77 49.53,25.02 49.53,35.56 50.8,36.83 54.61,36.83 v54.61,36.7
N$42  (via drill 0.35)
  Top 0.406: 62.46,31.75 v62.46,31.5 | v81.41,23.37 84.45,23.37 86.23,21.59 91.44,21.59 R27.1
  Top 0.508: R8.1 v62.46,31.5 | R1.2 62.46,31.75
  Top 1.27: R28.2 90.17,35.05 90.17,22.86 91.44,21.59
  Bottom 0.406: v62.46,31.5 73.28,31.5 v81.41,23.37
N$43
  Top 0.61: R31.2 58.74,49.62 Q25.2
N$44
  Top 0.61: R26.2 62.55,49.62 Q24.2
N$45
  Top 0.813: Q12.1 97.53,14.98 95.25,12.7 86.36,12.7 83.82,15.24 84.05,15.47 Q5.3
  Top 1.27: Q12.1 97.53,25.14 100.1,27.71 R16.2
N$46  (via drill 1)
  other vias: 86.36,53.34
N$47
  Top 1.27: R16.1 98.27,30.71 96.77,29.21 93.98,29.21 93.09,30.1 93.09,31.62 94.23,32.77 94.62,32.77 95.76,33.91 95.76,41.02 93.83,42.95 Q13.1 Q17.3
N$48  (2 unrouted)
  Top 0.406: Q24.3 63.67,45.72 64.77,45.72 66.04,44.45 66.04,41.55 R15.2 68.14,39.46 C4.1
  Top 0.508: Q28.4 72.97,36.2 68.33,36.2 68.14,36.38 C4.1
  Top 0.61: 67.43,31.63 RV1.1 | 67.43,31.63 69.98,29.08 RV1.2 71.34,28.16 67.56,24.38 C2.2 | 67.46,31.67 67.43,31.63 | C4.1 67.46,36.79
  Top 1.016: 76.2,36.83 Q28.4 | 76.2,33.8 76.2,36.83 | Q17.1 81.79,40.66 81.79,37.97 80.65,36.83 Q28.2 76.2,36.83
N$49  (via drill 1)
  other vias: 88.9,53.34
N$50
  Top 1.27: R12.1 97.53,32.99 Q13.3 Q16.1
N$51
  Top 1.27: Q14.3 101.86,20.82 R27.2
N$52
  Top 1.27: Q16.3 106.42,42.16 R28.1
N$53
  Top 0.61: C1.2 51.05,19.05 55.25,23.24 R18.2 55.22,24 53.98,24 53.21,24.77 IC1.2
N$54  (via drill 1)
  other vias: 91.44,53.34
N$55  (via drill 0.35)
  Top 0.508: R8.2 59.69,29.75 v59.69,28.45 C5.2 | v55.25,25.53 53.98,25.53 53.47,26.04 IC1.3
  Bottom 0.508: v59.69,28.45 56.77,25.53 v55.25,25.53
N$56  (via drill 1)
  other vias: 93.98,53.34
N$57  (via drill 1)
  other vias: 96.52,53.34
N$58  (via drill 1)
  other vias: 99.06,53.34
N$59  (via drill 1)
  other vias: 101.6,53.34
N$60  (via drill 1)
  other vias: 104.14,53.34
N$61  (via drill 1)
  other vias: 106.68,53.34
N$62  (via drill 1)
  other vias: 106.68,55.88
N$63  (via drill 1)
  other vias: 104.14,55.88
N$64  (via drill 1)
  other vias: 101.6,55.88
N$65  (via drill 1)
  other vias: 99.06,55.88
N$66  (via drill 1)
  other vias: 96.52,55.88
N$67  (via drill 1)
  other vias: 93.98,55.88
N$68  (via drill 1)
  other vias: 91.44,55.88
N$69  (via drill 1)
  other vias: 88.9,55.88
N$70  (via drill 1)
  other vias: 86.36,55.88
N$71  (via drill 1)
  other vias: 83.82,55.88
N$72  (via drill 1)
  other vias: 83.82,5.08
N$73  (via drill 1)
  other vias: 86.36,5.08
N$74  (via drill 1)
  other vias: 88.9,5.08
N$75  (via drill 1)
  other vias: 91.44,5.08
N$76  (via drill 1)
  other vias: 93.98,5.08
N$77  (via drill 1)
  other vias: 96.52,5.08
N$78  (via drill 1)
  other vias: 99.06,5.08
N$79  (via drill 1)
  other vias: 101.6,5.08
N$80  (via drill 1)
  other vias: 104.14,5.08
N$81  (via drill 1)
  other vias: 106.68,5.08
N$82  (via drill 1)
  other vias: 106.68,2.54
N$83  (via drill 1)
  other vias: 104.14,2.54
N$84  (via drill 1)
  other vias: 101.6,2.54
N$85  (via drill 1)
  other vias: 99.06,2.54
N$86  (via drill 1)
  other vias: 96.52,2.54
N$87  (via drill 1)
  other vias: 93.98,2.54
N$88  (via drill 1)
  other vias: 91.44,2.54
N$89  (via drill 1)
  other vias: 88.9,2.54
N$90  (via drill 1)
  other vias: 86.36,2.54
N$91  (via drill 1)
  other vias: 83.82,2.54
N$92  (4 unrouted)
N$93
  Top 0.254: R22.2 17.46,43.73 Q30.2
N$94  (1 unrouted)
N$95  (2 unrouted)
N$96
  Top 0.254: Q30.3 18.41,50.55 16.89,50.55 16.38,51.05 | 16.38,51.05 16.38,54.48 17.55,54.48 Q37.2 | 16.38,51.05 14.22,51.05 Q35.C
N$97
  Top 0.254: Q31.1 25.57,47.29 24.89,46.61 22.88,46.61 | 22.88,46.61 R29.1 21.19,46.63 19.37,48.45 Q30.1 | LED1.A 22.86,46.59 22.88,46.61
N$98
  Top 0.254: R32.1 24.28,51.84 24.77,52.32 26.4,52.32 Q32.1 | R32.1 22.63,52.07 20.83,52.07 19.49,53.41 Q37.1 | R32.1 R29.2
N$99  (1 unrouted)
  Top 0.254: Q33.C Q37.3
N$100  (1 unrouted)
  Top 0.254: Q41.C Q32.3
N$101  (3 unrouted)
N$102  (2 unrouted)
N$103  (3 unrouted)
N$104
  Top 0.254: Q40.C 27.43,68.58 28.38,68.58 | 28.38,68.58 31.75,68.58 Q38.3 | Q41.E 28.38,68.58
N$105  (1 unrouted)
N$106  (1 unrouted)
N$107  (4 unrouted)
N$108  (2 unrouted)
N$109  (1 unrouted)
N$110  (via drill 0.35)  (1 unrouted)
  Top 0.254: R41.2 v21.59,57.15 | v24.13,57.15 R42.2
  Bottom 0.254: v21.59,57.15 v24.13,57.15
N$111  (1 unrouted)
N$112
  Top 0.254: Q35.E 15.17,55.81 15.24,55.88 16.51,55.88 16.53,55.9 R41.1
N$113
  Top 0.254: Q38.1 32.54,66.76 R47.2 32.83,57.28 Q34.B
N$114  (2 unrouted)
N$115  (1 unrouted)
N$116  (1 unrouted)
N$117  (via drill 0.35)  (1 unrouted)
  Top 0.254: R39.1 v21.59,60.96 | R40.1 v24.13,60.96
  Bottom 0.254: v24.13,60.96 v21.59,60.96
N$118
  Top 0.254: R44.2 12.7,47.16 Q26.2
N$119  (1 unrouted)
  Top 0.254: Q26.1 10.16,46.84 LED4.A
N$122  (2 unrouted)
N$183
  Top 0.508: Q80.E 68.26,64.68 R63.1
N$184
  Top 0.61: Q55.1 68.69,72.07 D17.A 67.31,70.69 Q80.C
N$185
  Top 1.016: D18.C D21.A
N$186  (via drill 0.35)
  Top 0.508: Q80.B 65.91,65.76 65.91,63.75 64.64,62.48 58.42,62.48 57.53,63.37 57.53,68.63 D21.C 54.56,70.28 v54.36,70.48 | R67.2 53.72,86.51 v53.72,86.36
  Bottom 0.508: v54.36,70.48 55.63,71.75 55.63,77.98 53.72,79.88 v53.72,86.36
N$187
  Top 0.305: D17.C 62.23,73.23 62.23,74.04 57.76,74.04 R69.2
  Top 0.61: Q56.1 59.8,70.78 R69.2
N$188
  Top 0.406: Q55.2 69.85,70 69.85,68.58 68.58,67.31 62.23,67.31 60.96,68.58 Q56.3
N$189
  Top 0.406: Q64.3 62.27,96.65 65.66,96.65 66.29,96.01 66.29,93.73 64.64,92.08 64.64,81.41 66.04,80.01 66.04,75.97 R64.2
  Top 0.508: R64.2 65.66,73.81 65.66,70.1 65.02,69.47 64.22,69.47 64.17,69.52 63.18,69.52 Q56.2
N$190
  Top 0.406: R64.1 63.09,77.7 62.19,76.79 60.12,76.79 59.59,77.32 R62.2 | R61.1 59.46,90.32 60.96,91.82 60.96,93.89 60.66,94.19 57.98,94.19 R65.2
  Top 0.508: R62.2 58.42,81.43 58.42,89.13 R61.1
N$191  (via drill 0.35)
  Top 0.406: Q62.C 60.96,78.74 61.47,79.25 61.47,81.93 61.33,82.07 61.33,88.53 v60.96,88.9 | v58.42,96.52 58.42,97.55 57.95,98.02 R65.1
  Top 0.813: Q57.E 57.87,98.02 R65.1
  Bottom 0.406: v60.96,88.9 58.42,91.44 v58.42,96.52
N$192
  Top 0.813: R70.1 64.21,98.58 D22.A 64.04,100.16 Q57.B
N$193
  Top 0.406: Q81.3 67.31,100.63 D22.C 68.56,99.38 Q58.B
N$194
  Top 0.61: R66.2 66.36,106.77 Q81.2
N$195
  Top 1.016: D24.A D23.C
N$196  (via drill 0.35)
  Top 0.406: Q57.C 62.27,97.96 v62.61,98.3 | v72.52,102.49 72.52,101.58 Q58.E
  Bottom 0.406: v62.61,98.3 63.25,98.93 70.61,98.93 72.52,100.84 v72.52,102.49
N$197
  Top 0.406: Q62.E 60.85,74.68 58.67,74.68 57.15,76.2 R69.1
N$198
  Top 0.406: Q64.2 62.88,93.13 R70.2
N$199
  Top 0.406: Q62.B 57.53,78.21 57.53,92.08 57.66,92.2 57.53,92.33 | 53.36,92.33 57.53,92.33 | Q64.1 59.2,92.33 57.53,92.33
  Top 0.508: R91.1 52.12,91.08 R80.2 53.36,92.33
N$200
  Top 0.61: Q63.B 73.17,72.07 Q55.3 72.22,69.51 Q65.C
N$201
  Top 0.406: Q65.B 71.27,67.31 73.83,67.31 73.98,67.46
  Top 0.61: Q63.E 74.93,69.07 Q66.C 73.98,67.46 Q66.B
N$202
  Top 0.61: R72.1 72.07,64.68 Q65.E
N$203
  Top 0.61: R73.1 75.88,64.68 Q66.E
  Top 0.813: Q66.E 78.12,66.21 D19.A
N$204
  Top 0.61: 74.57,75.29 Q67.3
  Top 1.016: Q63.C 76.03,73.66 74.57,75.12 74.57,75.29
N$205  (via drill 0.35)
  Top 0.813: R77.2 74.93,79.91
  Top 1.016: D19.C v78.74,72.39 | v76.2,80.01 76.1,79.91 74.93,79.91 Q67.1
  Bottom 1.016: v78.74,72.39 76.2,74.93 v76.2,80.01
N$206
  Top 0.61: Q73.1 75.88,103.99 Q73.3 | Q73.3 76.03,101.94 Q61.2 | Q73.3 74.27,103.04 Q72.1
N$207
  Top 0.61: Q73.2 73.98,106.77 R75.2 77.7,107.72 78.74,106.68 D20.C
N$208
  Top 0.61: R74.2 70.17,106.77 Q72.2
N$209
  Top 0.406: Q61.1 74.89,100.52 74.89,101.26 72.77,103.38 71.46,103.38 Q72.3
  Top 0.61: Q72.3 70.02,101.94 Q58.C
N$210
  Top 0.61: Q61.3 73.83,98.89 76.43,96.29 Q79.3
N$211  (via drill 0.35)
  Top 0.61: 81.03,91.57 79.91,91.57 Q79.1
  Top 1.016: 81.03,91.57 81.03,87.38 80.01,86.36 76.43,86.36 R77.1 v74.93,90.17 | D20.A v78.74,99.06
  Bottom 1.016: v78.74,99.06 78.74,93.98 v74.93,90.17
N$212
  Top 0.508: Q75.C 63.54,68.45 65.53,68.45 66.55,69.47 66.55,73.38 R76.1
  Top 0.61: R90.2 73.66,88.62 73.66,85.09 70.36,81.79 C17.1 68.01,77.91 C19.2 68.01,74.84 R76.1
  Top 0.813: C17.1 73.03,77.6 Q67.2 Q67.4
  Top 1.016: Q74.4 84.65,85.92 79.93,81.2 Q67.4 82.6,74.93 86.33,74.93 Q59.1
N$213
  Top 0.406: Q75.B 62.01,66.75 62,66.75 61.44,67.31 60.79,67.31 Q76.C
  Top 0.508: Q76.C 57.78,70.31 57.78,71.12 56.9,72.01 56.03,72.01 R82.2
  Top 1.016: Q76.B 58.74,67.46 Q76.C
N$214
  Top 0.406: Q77.1 65.28,106.07 65.28,108.08 64.14,109.22 62.48,109.22 61.34,108.08 61.34,105.94 Q78.1 60.64,103.99 Q78.3 59.52,102.87 55.12,102.87 54.1,101.85 54.1,98.53 R83.1
N$215
  Top 1.016: R85.1 60.64,64.68 Q76.E
N$216
  Top 1.016: R84.1 64.45,64.68 Q75.E
N$217  (via drill 0.35)
  Top 0.508: 54.33,76.71 54.08,76.96 v53.09,76.96 | v54.61,93.85 R83.2
  Top 0.61: IC3.6 IC3.7 v49.28,81.91 | R82.1 54.33,76.71
  Bottom 0.508: v53.09,76.96 53.09,78.1 v49.28,81.91 49.53,82.17 49.53,92.71 50.8,93.98 54.61,93.98 v54.61,93.85
N$218  (via drill 0.35)
  Top 0.406: 62.46,88.9 v62.46,88.65 | v81.41,80.52 84.45,80.52 86.23,78.74 91.44,78.74 R87.1
  Top 0.508: R68.1 v62.46,88.65 | R61.2 62.46,88.9
  Top 1.27: R88.2 90.17,92.2 90.17,80.01 91.44,78.74
  Bottom 0.406: v62.46,88.65 73.28,88.65 v81.41,80.52
N$219
  Top 0.61: R89.2 58.74,106.77 Q78.2
N$220
  Top 0.61: R86.2 62.55,106.77 Q77.2
N$221
  Top 0.813: Q68.1 97.53,72.13 95.25,69.85 86.36,69.85 83.82,72.39 84.05,72.62 Q59.3
  Top 1.27: Q68.1 97.53,82.29 100.1,84.86 R79.2
N$222
  Top 1.27: R79.1 98.27,87.86 96.77,86.36 93.98,86.36 93.09,87.25 93.09,88.77 94.23,89.92 94.62,89.92 95.76,91.06 95.76,98.17 93.83,100.1 Q69.1 Q60.3
N$223  (2 unrouted)
  Top 0.406: Q77.3 63.67,102.87 64.77,102.87 66.04,101.6 66.04,98.7 R78.2 68.14,96.6 C20.1
  Top 0.508: Q79.4 72.97,93.34 68.33,93.34 68.14,93.53 C20.1
  Top 0.61: 67.43,88.78 RV3.1 | 67.43,88.78 69.98,86.23 RV3.2 71.34,85.31 67.56,81.53 C17.2 | 67.46,88.82 67.43,88.78 | C20.1 67.46,93.94
  Top 1.016: 76.2,93.98 Q79.4 | 76.2,90.95 76.2,93.98 | Q60.1 81.79,97.81 81.79,95.12 80.65,93.98 Q79.2 76.2,93.98
N$224
  Top 1.27: Q68.3 95.25,74.9 R71.2 97.69,84.86 99.19,86.36 103.76,86.36 106.42,83.7 Q70.1
N$225
  Top 1.27: R71.1 97.53,90.14 Q69.3 Q71.1
N$226
  Top 1.27: Q70.3 101.86,77.97 R87.2
N$227
  Top 1.27: Q71.3 106.42,99.3 R88.1
N$228
  Top 0.61: C18.2 51.05,76.2 55.25,80.39 R81.2 55.22,81.15 53.98,81.15 53.21,81.91 IC3.2
N$229  (via drill 0.35)
  Top 0.508: R68.2 59.69,86.89 v59.69,85.6 C21.2 | v55.25,82.68 53.98,82.68 53.47,83.19 IC3.3
  Bottom 0.508: v59.69,85.6 56.77,82.68 v55.25,82.68
N$230  (via drill 0.35)
  Top 0.406: Q81.1 67.16,104.14 62.23,104.14 61.47,103.38 61.47,102.11 61.09,101.73 56.44,101.73 D23.A
  Top 0.508: D23.A v55.88,93.47 | R67.1 56.62,90.91 v56.64,90.93
  Bottom 0.508: v55.88,93.47 55.88,91.44 56.13,91.44 v56.64,90.93
N$232
  Top 0.61: R92.1 43.94,79.25 44.45,78.74 44.45,78.61 C18.1 47.5,76.84 47.5,78.1 51.05,78.1 52.32,79.38 52.32,80.47 IC3.1
N$233
  Top 0.508: C22.2 44.7,84.81 R92.2 44.35,84.45 IC3.5
N$234  (via drill 1)
  other vias: 83.82,110.49
N$235  (via drill 1)
  other vias: 86.36,110.49
N$236  (via drill 1)
  other vias: 88.9,110.49
N$237  (via drill 1)
  other vias: 91.44,110.49
N$238  (via drill 1)
  other vias: 93.98,110.49
N$239  (via drill 1)
  other vias: 96.52,110.49
N$240  (via drill 1)
  other vias: 99.06,110.49
N$241  (via drill 1)
  other vias: 101.6,110.49
N$242  (via drill 1)
  other vias: 104.14,110.49
N$243  (via drill 1)
  other vias: 106.68,110.49
N$244  (via drill 1)
  other vias: 106.68,113.03
N$245  (via drill 1)
  other vias: 104.14,113.03
N$246  (via drill 1)
  other vias: 101.6,113.03
N$247  (via drill 1)
  other vias: 99.06,113.03
N$248  (via drill 1)
  other vias: 96.52,113.03
N$249  (via drill 1)
  other vias: 93.98,113.03
N$250  (via drill 1)
  other vias: 91.44,113.03
N$251  (via drill 1)
  other vias: 88.9,113.03
N$252  (via drill 1)
  other vias: 86.36,113.03
N$253  (via drill 1)
  other vias: 83.82,113.03
N$254  (via drill 1)
  other vias: 83.82,62.23
N$255  (via drill 1)
  other vias: 86.36,62.23
N$256  (via drill 1)
  other vias: 88.9,62.23
N$257  (via drill 1)
  other vias: 91.44,62.23
N$258  (via drill 1)
  other vias: 93.98,62.23
N$259  (via drill 1)
  other vias: 96.52,62.23
N$260  (via drill 1)
  other vias: 99.06,62.23
N$261  (via drill 1)
  other vias: 101.6,62.23
N$262  (via drill 1)
  other vias: 104.14,62.23
N$263  (via drill 1)
  other vias: 106.68,62.23
N$264  (via drill 1)
  other vias: 106.68,59.69
N$265  (via drill 1)
  other vias: 104.14,59.69
N$266  (via drill 1)
  other vias: 101.6,59.69
N$267  (via drill 1)
  other vias: 99.06,59.69
N$268  (via drill 1)
  other vias: 96.52,59.69
N$269  (via drill 1)
  other vias: 93.98,59.69
N$270  (via drill 1)
  other vias: 91.44,59.69
N$271  (via drill 1)
  other vias: 88.9,59.69
N$272  (via drill 1)
  other vias: 86.36,59.69
N$273  (via drill 1)
  other vias: 83.82,59.69